# EAGLE design ATTINY-warmthV0.5 (EAGLE 6.1)
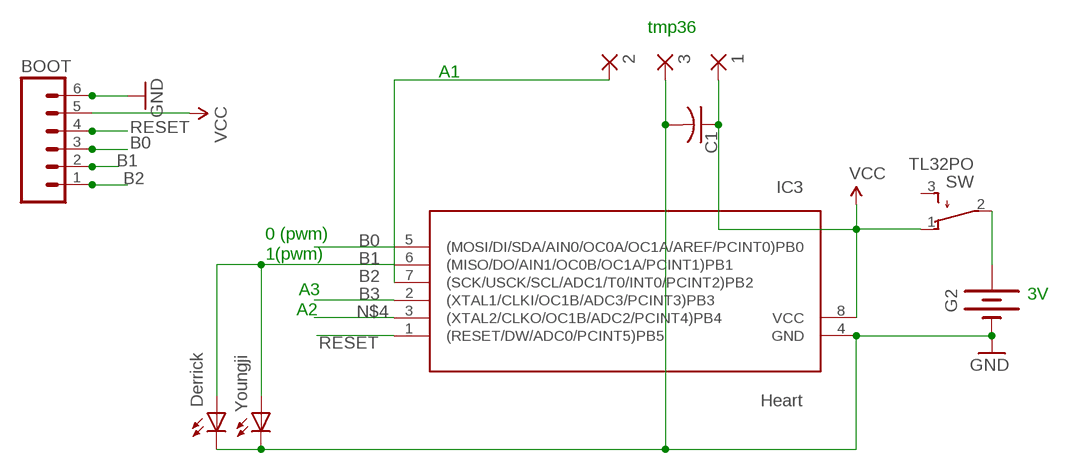
[diagram p0: schematic, sheet 1]

## Parts
1  WIREPADSMD1,27-254  [SMD1,27-2,54]
2  WIREPADSMD1,27-254  [SMD1,27-2,54]
3  WIREPADSMD1,27-254  [SMD1,27-2,54]
BOOT  M06SIP  [1X06]
C1  C-USC0805K  [C0805K]
G2  BATTERY20SMD  [BATTCON_20MM]
IC3  Heart  ATTINY85V-10S  [SOIC8]
SW  TL32PO  [TL3XPO]
TX  Derrick  LED3MM  [LED3MM]
TX1  Youngji  LED3MM  [LED3MM]

## Nets
B0: BOOT.3 IC3.5((MOSI/DI/SDA/AIN0/OC0A/OC1A/AREF/PCINT0)PB0)
B1: BOOT.2 IC3.6((MISO/DO/AIN1/OC0B/OC1A/PCINT1)PB1) TX1.A TX.A
B2: 2.1(P) BOOT.1 IC3.7((SCK/USCK/SCL/ADC1/T0/INT0/PCINT2)PB2)
B3: IC3.2((XTAL1/CLKI/OC1B/ADC3/PCINT3)PB3)
GND: 3.1(P) BOOT.6 C1.2 G2.2(-) IC3.4(GND) TX1.K(C) TX.K(C)
N$4: IC3.3((XTAL2/CLKO/OC1B/ADC2/PCINT4)PB4)
N$6: G2.1(+) SW.2(P)
RESET: BOOT.4 IC3.1((RESET/DW/ADC0/PCINT5)PB5)
VCC: 1.1(P) BOOT.5 C1.1 IC3.8(VCC) SW.1(O)
Unconnected: SW.3(S)

## Notes on the sheet
- tmp36
- A1
- 0 (pwm)
- 1(pwm)
- A3 | 3V
- A2

## Library data of the parts
1-3 = wirepad:WIREPAD: Wire PAD connect wire on PCB
BOOT = SparkFun:M06: Header 6 Standard 6-pin 0.1" header. Use with straight break away headers (SKU : PRT-00116), right angle break away headers (PRT-00553), swiss pins (PRT-00743), machine pins (PRT-00117), and female headers (PRT-00115). Molex polarized connector foot print use with SKU : PRT-08094 with associated crimp pins and housings. NOTES ON THE VARIANTS LOCK and LOCK_LONGPADS... This footprint was designed to help hold the alignment of a through-hole component (i.e. 6-pin header) while soldering it into place. You may notice that each hole has been shifted either up or down by 0.005 of an inch from it's more standard position (which is a perfectly straight line). This slight alteration caused the pins (the squares in the middle) to touch the edges of the holes. Because they are alternating, it causes a "brace" to hold the component in place. 0.005 has proven to be the perfect amount of "off-center" position when using our standard breakaway headers. Although looks a little odd when you look at the bare footprint, once you have a header in there, the alteration is very hard to notice. Also, if you push a header all the way into place, it is covered up entirely on the bottom side. This idea of altering the position of holes to aid alignment will be further integrated into the Sparkfun Library for other footprints. It can help hold any component with 3 or more connection pins.
C1 = rcl:C-US: CAPACITOR, American symbol
G2 = SparkFun:BATTERY: Battery Holders Various common sizes : AA, AAA, 20mm coin cell and 12mm coin cell.
IC3 = avr:ATTINY85: MICROCONTROLLER 8 Kbytes FLASH 512 bytes EEPROM 512 bytes RAM 4-channel 10 bit ADC USI
SW = switch:TL32PO: TINY SWITCH ON - MOM Source: http://www2.produktinfo.conrad.com/datenblaetter/700000-724999/705152-da-01-de-Subminiaturschalter_TL_36YO.pdf
TX TX1 = led:LED: LED OSRAM: - CHIPLED LG R971, LG N971, LY N971, LG Q971, LY Q971, LO R971, LY R971 LH N974, LH R974 LS Q976, LO Q976, LY Q976 LO Q996 - Hyper CHIPLED LW Q18S LB Q993, LB Q99A, LB R99A - SideLED LS A670, LO A670, LY A670, LG A670, LP A670 LB A673, LV A673, LT A673, LW A673 LH A674 LY A675 LS A676, LA A676, LO A676, LY A676, LW A676 LS A679, LY A679, LG A679 - Hyper Micro SIDELED® LS Y876, LA Y876, LO Y876, LY Y876 LT Y87S - SmartLED LW L88C, LW L88S LB L89C, LB L89S, LG L890 LS L89K, LO L89K, LY L89K LS L896, LA L896, LO L896, LY L896 - TOPLED LS T670, LO T670, LY T670, LG T670, LP T670 LSG T670, LSP T670, LSY T670, LOP T670, LYG T670 LG T671, LOG T671, LSG T671 LB T673, LV T673, LT T673, LW T673 LH T674 LS T676, LA T676, LO T676, LY T676, LB T676, LH T676, LSB T676, LW T676 LB T67C, LV T67C, LT T67C, LS T67K, LO T67K, LY T67K, LW E67C LS E67B, LA E67B, LO E67B, LY E67B, LB E67C, LV E67C, LT E67C LW T67C LS T679, LY T679, LG T679 LS T770, LO T770, LY T770, LG T770, LP T770 LB T773, LV T773, LT T773, LW T773 LH T774 LS E675, LA E675, LY E675, LS T675 LS T776, LA T776, LO T776, LY T776, LB T776 LHGB T686 LT T68C, LB T68C - Hyper Mini TOPLED® LB M676 - Mini TOPLED Santana® LG M470 LS M47K, LO M47K, LY M47K Source: http://www.osram.convergy.de LUXEON: - LUMILED® LXK2-PW12-R00, LXK2-PW12-S00, LXK2-PW14-U00, LXK2-PW14-V00 LXK2-PM12-R00, LXK2-PM12-S00, LXK2-PM14-U00 LXK2-PE12-Q00, LXK2-PE12-R00, LXK2-PE12-S00, LXK2-PE14-T00, LXK2-PE14-U00 LXK2-PB12-K00, LXK2-PB12-L00, LXK2-PB12-M00, LXK2-PB14-N00, LXK2-PB14-P00, LXK2-PB14-Q00 LXK2-PR12-L00, LXK2-PR12-M00, LXK2-PR14-Q00, LXK2-PR14-R00 LXK2-PD12-Q00, LXK2-PD12-R00, LXK2-PD12-S00 LXK2-PH12-R00, LXK2-PH12-S00 LXK2-PL12-P00, LXK2-PL12-Q00, LXK2-PL12-R00 Source: www.luxeon.com KINGBRIGHT: KA-3528ASYC Source: www.kingbright.com

## Net classes
1 power: width 0.61 mm, drill 0.61 mm, clearance 0.254 mm
2 GND: width 0.914 mm, drill 0.406 mm

## Board
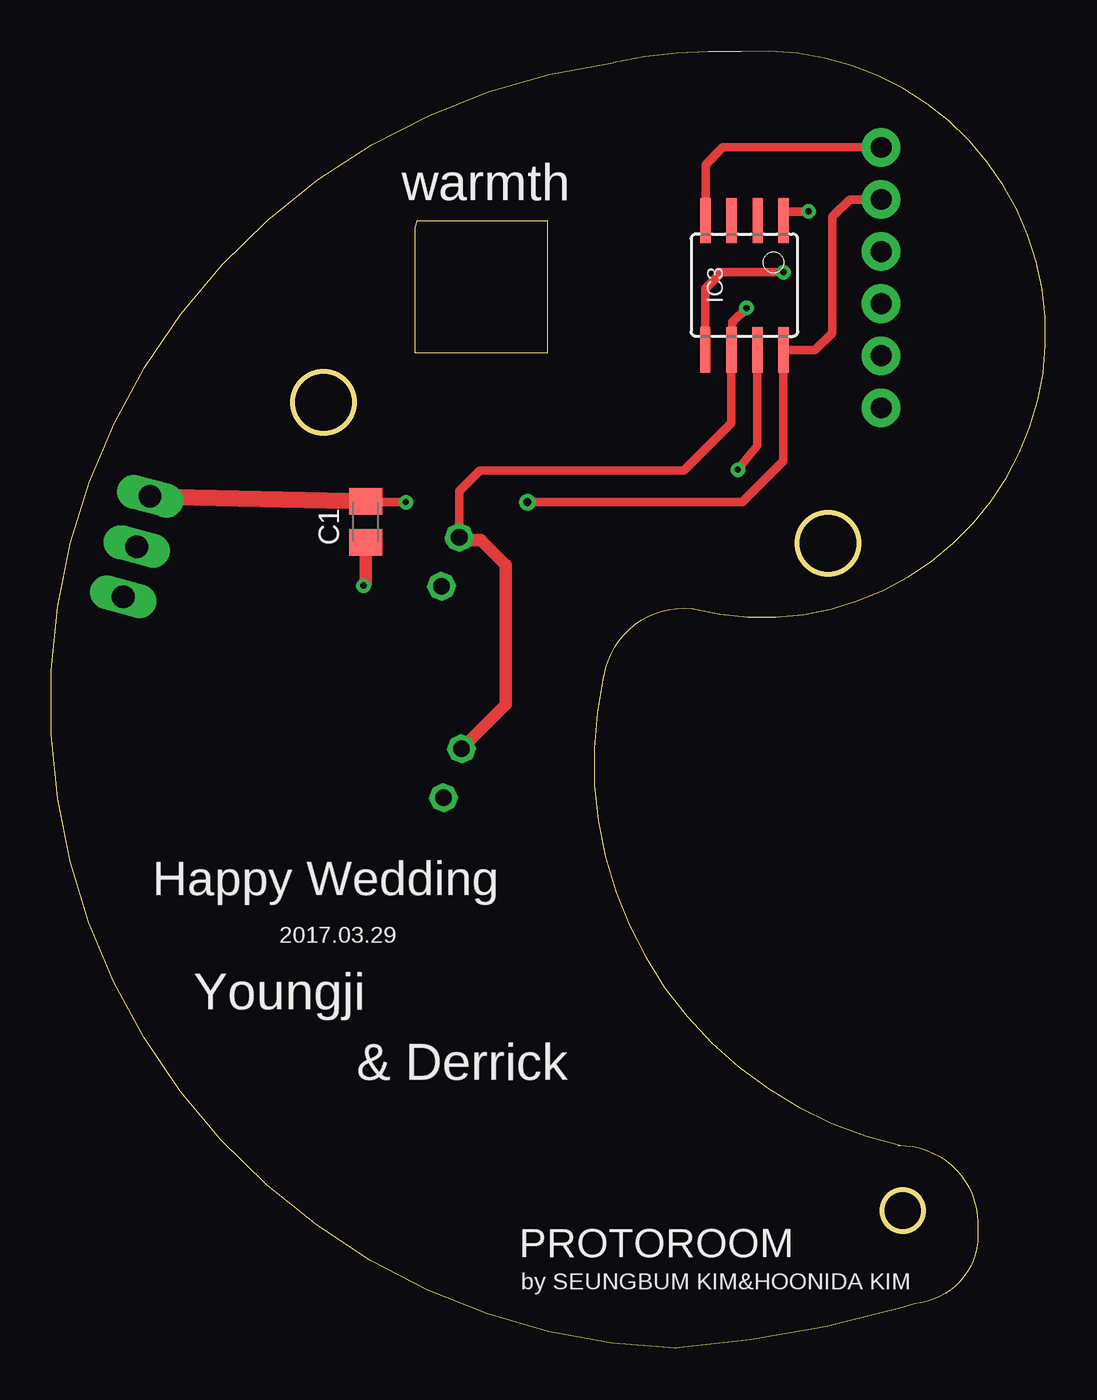
[diagram p1: board, top side]
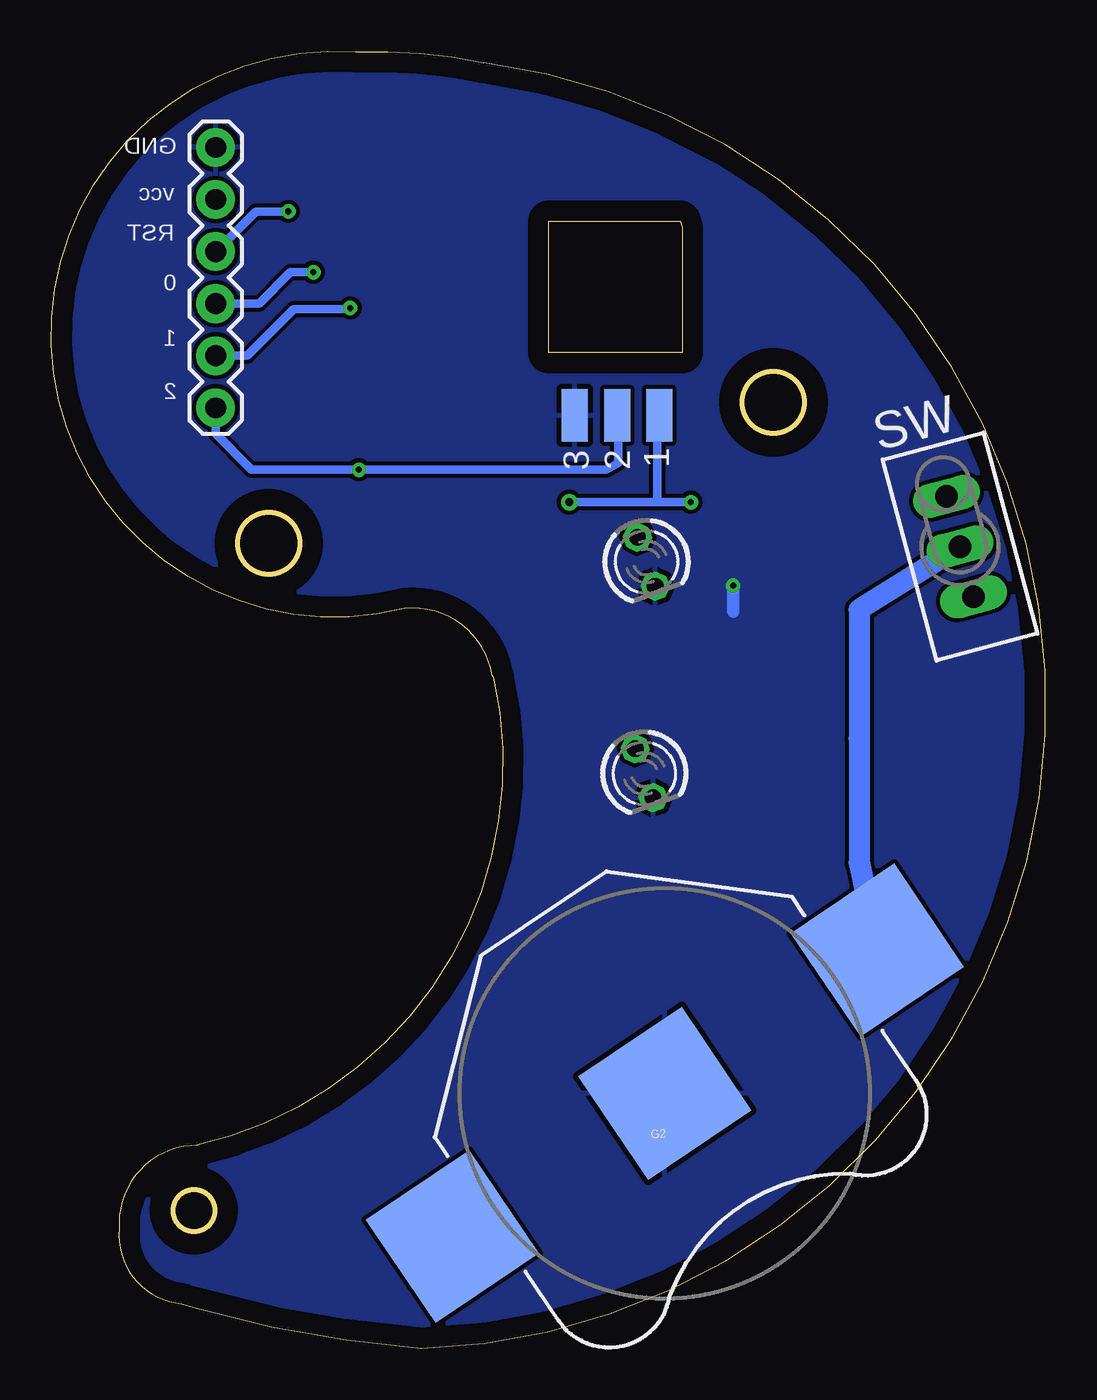
[diagram p2: board, bottom side, seen from below]

Size 48.48 x 63.27 mm. Coordinates in mm from the lower left corner, seen from the top.
Outline: 30.47,0 arc-171 27.4,62.71 arc-15 33.64,63.24 arc-199 31.26,36.09 arc87 26.97,32.81 26.92,32.76 arc90 41.42,9.9
Outline: 41.32,9.9 arc-90 45.18,6.14 45.18,5.82 arc-90 42.11,2.17 41.37,1.96 arc-12 30.41,0
Outline: 17.82,54.98 17.71,54.66 17.71,49.05 17.71,48.58 24.22,48.58 24.22,49.05 24.22,54.98 17.82,54.98
Outline: circle at 13.27,46.14 radius 1.5
Outline: circle at 41.53,6.72 radius 1
Outline: circle at 37.88,39.26 radius 1.5
Copper layers (1*16): Top 0.035mm / dielectric 1.5mm / Bottom 0.035mm
Design rules: minimum track width 10mil, minimum drill 24mil, track to track 8mil, track to pad 8mil, pad to pad 8mil, via to via 8mil, smd to smd 8mil, copper to edge 40mil, drill to drill 8mil, minimum pad ring 10mil, minimum via ring 8mil, stop-mask expansion 4mil, vias tented up to drill 0mil, thermal gap 10mil

### Footprints (pad centres in the part's own frame; a part is rotated, then mirrored left to right if it is on the bottom)
SMD1,27-2,54 = smd 1.27 x 2.54: 1 0,0
1X06 = drill 1.016 pad 1.88: 1 0,0; 2 2.54,0; 3 5.08,0; 4 7.62,0; 5 10.16,0; 6 12.7,0
C0805K = smd 1.3 x 1.6: 1 -1,0; 2 1,0
BATTCON_20MM = smd 6.07 x 6.07: 1 -12.5,0; 2 0,0; 3 12.5,0
SOIC8 = smd 0.5 x 2.2: 1 -1.905,-3.154; 2 -0.645,-3.154; 3 0.625,-3.154; 4 1.895,-3.154; 5 1.905,3.154; 6 0.635,3.154; 7 -0.635,3.154; 8 -1.905,3.154
TL3XPO = drill 1.1 pad 1.422 long: 1 -2.54,0; 2 0,0; 3 2.54,0
LED3MM = drill 0.813 octagon: A -1.27,0; K 1.27,0

### Placement (x,y rotation side)
1  18.83,45.51 0 bottom
2  20.89,45.51 0 bottom
3  22.95,45.51 0 bottom
BOOT  40.47,45.88 90 bottom
C1  15.33,40.32 270 top
G2  18.56,12.44 214 bottom
IC3  33.8,51.86 180 top
SW  4.17,39.11 285 bottom
TX  19.46,38.36 290 bottom
TX1  19.57,28.05 290 bottom

### Tracks (layer width: path | path; a pad name or v marks a point on that pad's centre or on a via)
B0  (via drill 0.3)
  Top 0.406: IC3.5 | IC3.5 31.9,51.7 32.69,52.49 v35.71,52.49
  Bottom 0.406: v35.71,52.49 36.82,52.49 38.35,50.96 BOOT.3 | BOOT.3
B1  (via drill 0.3)
  Top 0.254: TX.A 19.65,39.56 19.51,39.42
  Top 0.406: v33.91,50.75 33.22,50.06 33.22,48.84 33.17,48.79 IC3.6 33.17,45.14 30.84,42.81 20.89,42.81 19.88,41.8 19.88,39.69 19.94,39.63 19.94,39.6 TX.A
  Top 0.61: 19.51,39.42 20.94,39.42 22.16,38.21 22.16,31.4 TX1.A
  Bottom 0.406: 19.41,39.69 TX.A | BOOT.2 38.93,48.42 36.66,50.69 33.96,50.69 v33.91,50.75
B2  (via drill 0.3)
  Top 0.406: IC3.7 34.44,45.35 34.44,44.13 34.44,44.03 v33.48,42.86
  Bottom 0.406: 20.94,45.46 20.84,45.35 20.84,43.18 21.42,42.86 v33.48,42.86 38.72,42.86 40.47,44.61 BOOT.1 | 20.94,45.46 | 20.94,45.46 2.1
GND  (via drill 0.3)
  Top 0.406: IC3.4 31.91,57.74 32.74,58.58 BOOT.6 | BOOT.6
  Top 0.61: C1.2 15.33,39.37 | 15.33,39.37 | 15.33,39.37 15.33,37.31 v15.23,37.2
  Bottom 0.61: v15.23,37.2 15.23,35.93
  pour Bottom: -0.44,63.76 56.32,63.61 56.69,0.38 0.15,0.74
N$6
  Bottom 1.016: SW.2 9.09,36.04 9.09,29.74 9.09,23.7 G2.1
RESET  (via drill 0.3)
  Top 0.406: v36.92,55.46 35.65,55.46 35.71,55.4 IC3.1
  Bottom 0.406: BOOT.4 38.51,55.46 v36.92,55.46
VCC  (via drill 0.3, 0.4)
  Top 0.406: BOOT.5 38.93,56.04 38.09,55.19 38.09,49.53 37.24,48.68 35.73,48.68 | 35.73,48.68 IC3.8 | 35.73,48.68 35.71,48.68 35.71,43.29 33.7,41.28 v23.22,41.28 | C1.1 15.38,41.28 v17.29,41.28
  Top 0.813: SW.1 15.6,41.29 15.6,41.43 15.33,41.43 C1.1
  Bottom 0.406: v23.22,41.28 18.98,41.28 18.93,41.28 | 18.93,41.28 18.93,45.4 1.1 | v17.29,41.28 18.93,41.28
  Bottom 0.61: 1.1 arc90 1.1

### Text on the board
tPlace: 2017.03.29
tNames: warmth | Happy Wedding | Youngji | & Derrick | PROTOROOM | by SEUNGBUM KIM&HOONIDA KIM
bNames: GND | vcc | RST | 0 | 1 | 2